# EAGLE design SLA_1500_CAM_V5 (EAGLE 9.2.1)
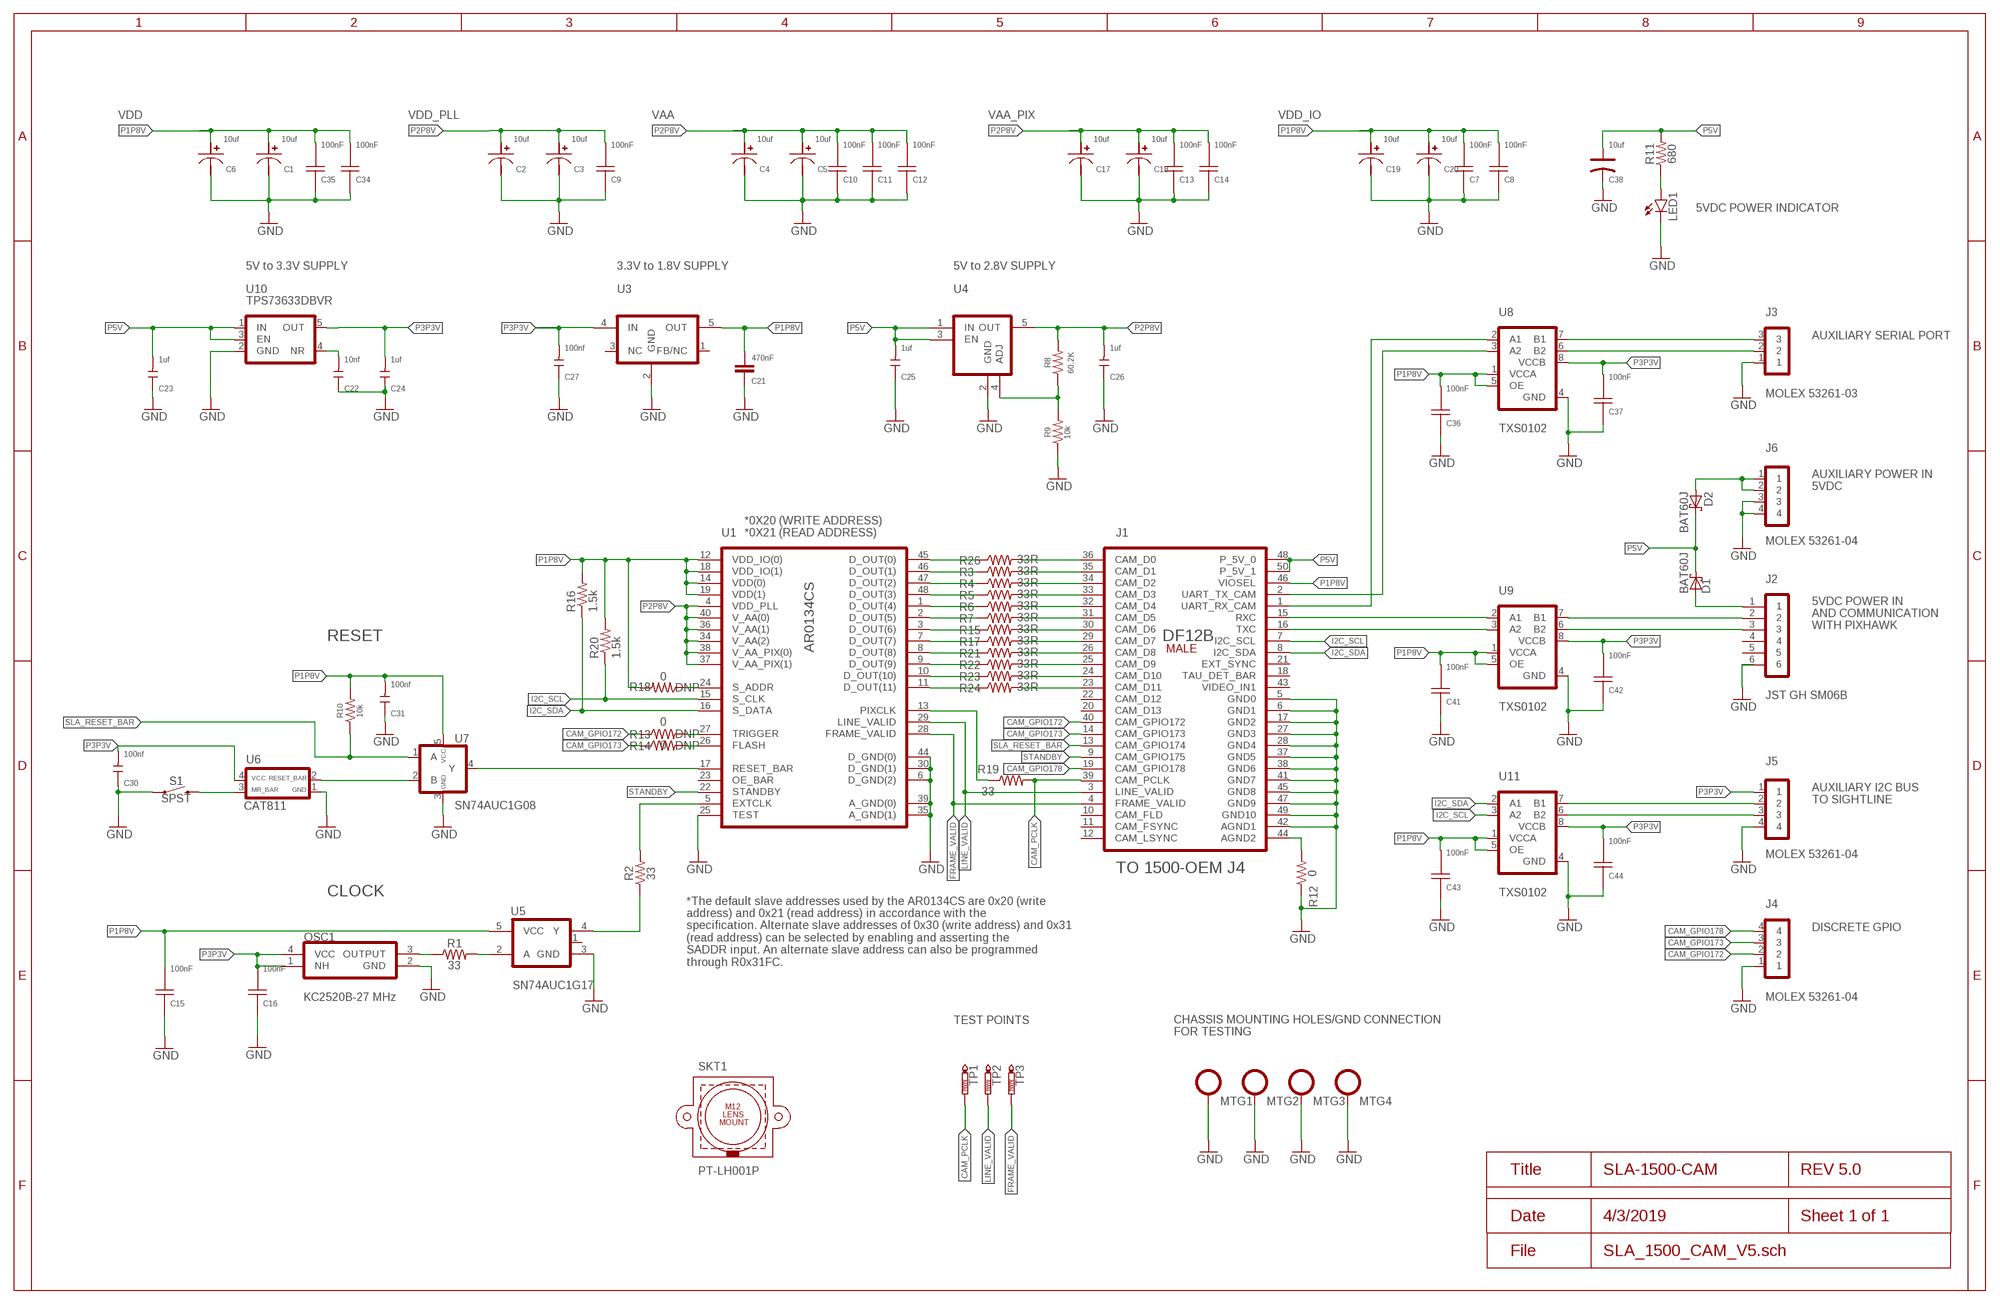
[diagram p0: schematic, sheet 1]
FRAME1 (FRAME_B_L): SPICEPREFIX: X

## Parts
C1  10uf  F980G106MUA  [0402]
C2  10uf  F980G106MUA  [0402]
C3  10uf  F980G106MUA  [0402]
C4  10uf  F980G106MUA  [0402]
C5  10uf  F980G106MUA  [0402]
C6  10uf  F980G106MUA  [0402]
C7  CAP0201100NF  [R0201]
C8  CAP0201100NF  [R0201]
C9  CAP0201100NF  [R0201]
C10  CAP0201100NF  [R0201]
C11  CAP0201100NF  [R0201]
C12  CAP0201100NF  [R0201]
C13  CAP0201100NF  [R0201]
C14  CAP0201100NF  [R0201]
C15  CAP0201100NF  [R0201]
C16  CAP0201100NF  [R0201]
C17  10uf  F980G106MUA  [0402]
C18  10uf  F980G106MUA  [0402]
C19  10uf  F980G106MUA  [0402]
C20  10uf  F980G106MUA  [0402]
C21  470nF  470NF-0402-16V-10%  [0402]
C22  10nf  CERAMIC-10NF-50V-10%-X7R(0402)  [C0402]
C23  1uf  CERAMIC-1UF-10V-10%-X5R(0402)  [C0402]
C24  1uf  CERAMIC-1UF-10V-10%-X5R(0402)  [C0402]
C25  1uf  CERAMIC-1UF-10V-10%-X5R(0402)  [C0402]
C26  1uf  CERAMIC-1UF-10V-10%-X5R(0402)  [C0402]
C27  100nf  CERAMIC-100NF-25V-10%-X7R(0402)  [C0402]
C30  100nf  CERAMIC-100NF-25V-10%-X7R(0402)  [C0402]
C31  100nf  CERAMIC-100NF-25V-10%-X7R(0402)  [C0402]
C34  CAP0201100NF  [R0201]
C35  CAP0201100NF  [R0201]
C36  CAP0201100NF  [R0201]
C37  CAP0201100NF  [R0201]
C38  10uf  TANTALUM-SMD-10UF-10V-10%(AVX-A)  [AVX-A]
C41  CAP0201100NF  [R0201]
C42  CAP0201100NF  [R0201]
C43  CAP0201100NF  [R0201]
C44  CAP0201100NF  [R0201]
D1  BAT60J  [SOD323_ST]
D2  BAT60J  [SOD323_ST]
J1  DF12B(5.0)-50DS-0.5(86)SMT  [DF12B(5.0)-50DS-0.5V(86)]
J2  JST GH SM06B  JST_GH_SM06B-GHS-TB  [JST_SM06B-GHS-TB]
J3  MOLEX 53261-03  MOLEX53261-03  [53261-03]
J4  MOLEX 53261-04  MOLEX53261-04  [53261-04]
J5  MOLEX 53261-04  MOLEX53261-04  [53261-04]
J6  MOLEX 53261-04  MOLEX53261-04  [53261-04]
LED1  LEDCHIP-LED0603  [CHIP-LED0603]
MTG1  SLA_MOUNTING  [SLA_MOUNTING]
MTG2  SLA_MOUNTING  [SLA_MOUNTING]
MTG3  SLA_MOUNTING  [SLA_MOUNTING]
MTG4  SLA_MOUNTING  [SLA_MOUNTING]
OSC1  KC2520B-27MHZ  [2.5X2.0_SMDCRYSTAL]
R1  33  RESISTOR0402  [0402]
R2  33  RESISTOR0402  [0402]
R3  33R  R-US_R0201  [R0201]
R4  33R  R-US_R0201  [R0201]
R5  33R  R-US_R0201  [R0201]
R6  33R  R-US_R0201  [R0201]
R7  33R  R-US_R0201  [R0201]
R8  60.2K  62KOHM-0603-1/10W-5%  [0603]
R9  10k  10KOHM-0603-1/10W-1%  [0603]
R10  10k  10KOHM-0603-1/10W-1%  [0603]
R11  680  680OHM-0603-1/10W-5%  [0603]
R12  0  RESISTOR0402  [0402]
R13  0  RESISTOR0402  [0402]
R14  0  RESISTOR0402  [0402]
R15  33R  R-US_R0201  [R0201]
R16  1.5k  R-US_R0201  [R0201]
R17  33R  R-US_R0201  [R0201]
R18  0  RESISTOR0402  [0402]
R19  33  RESISTOR0402  [0402]
R20  1.5k  R-US_R0201  [R0201]
R21  33R  R-US_R0201  [R0201]
R22  33R  R-US_R0201  [R0201]
R23  33R  R-US_R0201  [R0201]
R24  33R  R-US_R0201  [R0201]
R26  33R  R-US_R0201  [R0201]
S1  SPST  MOMENTARY-SWITCH-SPST-SMD-4.6X2.8MM  [TACTILE_SWITCH_SMD_4.6X2.8MM]
SKT1  PT-LH001P  M12_LENS_MOUNT  [M12_HOLDER]
TP1  PTR1TP08SQ  [TP08SQ]
TP2  PTR1TP08SQ  [TP08SQ]
TP3  PTR1TP08SQ  [TP08SQ]
U1  AR0134CS-ILCC48  [ILCC48_KD]
U3  TPS71518DCKR  [TI-SC70-5]
U4  AP7331-WG-7  [SOT-25]
U5  SN74AUC1G17  [SOT23-5]
U6  CAT811  [SOT-143-4]
U7  SN74AUC1G08  [SOT23-5]
U8  TXS0102  TXS0102DQM  [X2SON(8)1.8X1.2MM]
U9  TXS0102  TXS0102DQM  [X2SON(8)1.8X1.2MM]
U10  TPS73633DBVR  [SOT23-5]
U11  TXS0102  TXS0102DQM  [X2SON(8)1.8X1.2MM]

## Nets
CAM_GPIO172: J1.40(CAM_GPIO172) J4.2 R13.1
CAM_GPIO173: J1.14(CAM_GPIO173) J4.3 R14.1
CAM_GPIO178: J1.19(CAM_GPIO178) J4.4
CAM_PCLK: J1.39(CAM_PCLK) R19.2 TP1.TP
FRAME_VALID: J1.4(FRAME_VALID) TP3.TP U1.28(FRAME_VALID)
GND: C1.2 C2.2 C3.2 C4.2 C5.2 C6.2 C7.2 C8.2 C9.2 C10.2 C11.2 C12.2 C13.2 C14.2 C15.2 C16.2 C17.2 C18.2 C19.2 C20.2 C21.2 C22.1 C23.1 C24.1 C25.1 C26.1 C27.1 C30.1 C31.1 C34.2 C35.2 C36.2 C37.2 C38.- C41.2 C42.2 C43.2 C44.2 J1.5(GND0) J1.6(GND1) J1.17(GND2) J1.27(GND3) J1.28(GND4) J1.37(GND5) J1.38(GND6) J1.41(GND7) J1.42(AGND1) J1.45(GND8) J1.47(GND9) J1.49(GND10) J2.6 J3.1 J4.1 J5.4 J6.3 J6.4 LED1.C MTG1.P$1 MTG2.P$1 MTG3.P$1 MTG4.P$1 OSC1.2(GND) R9.1 R12.1 S1.1 S1.2 U1.6(D_GND(2)) U1.25(TEST) U1.30(D_GND(1)) U1.35(A_GND(1)) U1.39(A_GND(0)) U1.44(D_GND(0)) U3.2(GND) U4.2(GND) U5.3(GND) U6.1(GND) U7.3(GND) U8.4(GND) U9.4(GND) U10.2(GND) U11.4(GND)
I2C_SCL: J1.7(I2C_SCL) R20.1 U1.15(S_CLK) U11.3(A2)
I2C_SDA: J1.8(I2C_SDA) R16.1 U1.16(S_DATA) U11.2(A1)
LINE_VALID: J1.3(LINE_VALID) TP2.TP U1.29(LINE_VALID)
N$1: J2.3 U9.6(B2)
N$2: R26.1 U1.45(D_OUT(0))
N$3: J1.36(CAM_D0) R26.2
N$4: R3.1 U1.46(D_OUT(1))
N$5: J1.35(CAM_D1) R3.2
N$6: R4.1 U1.47(D_OUT(2))
N$7: J1.34(CAM_D2) R4.2
N$8: R5.1 U1.48(D_OUT(3))
N$9: J1.33(CAM_D3) R5.2
N$10: R6.1 U1.1(D_OUT(4))
N$11: J1.32(CAM_D4) R6.2
N$12: R7.1 U1.2(D_OUT(5))
N$13: J3.3 U8.7(B1)
N$14: J1.31(CAM_D5) R7.2
N$15: R1.2 U5.2(A)
N$16: OSC1.3(OUTPUT) R1.1
N$17: J2.2 U9.7(B1)
N$18: J3.2 U8.6(B2)
N$19: J1.1(UART_RX_CAM) U8.2(A1)
N$20: J1.2(UART_TX_CAM) U8.3(A2)
N$21: C22.2 U10.4(NR)
N$22: R15.1 U1.3(D_OUT(6))
N$23: R8.1 R9.2 U4.4(ADJ)
N$24: J1.30(CAM_D6) R15.2
N$25: R2.1 U5.4(Y)
N$26: R2.2 U1.5(EXTCLK)
N$27: S1.3 S1.4 U6.3(MR_BAR)
N$28: U6.2(RESET_BAR) U7.2(B)
N$29: U1.17(RESET_BAR) U7.4(Y)
N$30: LED1.A R11.1
N$31: J1.44(AGND2) R12.2
N$32: R13.2 U1.27(TRIGGER)
N$33: R14.2 U1.26(FLASH)
N$34: D1.A J2.1
N$35: J1.15(RXC) U9.2(A1)
N$36: J1.16(TXC) U9.3(A2)
N$37: J5.2 U11.7(B1)
N$38: J5.3 U11.6(B2)
N$39: D2.A J6.1 J6.2
N$40: R17.1 U1.7(D_OUT(7))
N$41: J1.29(CAM_D7) R17.2
N$42: R21.1 U1.8(D_OUT(8))
N$43: J1.26(CAM_D8) R21.2
N$44: R22.1 U1.9(D_OUT(9))
N$45: J1.25(CAM_D9) R22.2
N$46: R23.1 U1.10(D_OUT(10))
N$47: J1.24(CAM_D10) R23.2
N$48: R24.1 U1.11(D_OUT(11))
N$49: J1.23(CAM_D11) R24.2
N$52: R18.1 U1.24(S_ADDR)
P1P8V: C1.1 C6.1 C7.1 C8.1 C15.1 C19.1 C20.1 C21.1 C31.2 C34.1 C35.1 C36.1 C41.1 C43.1 J1.46(VIOSEL) R10.2 R16.2 R18.2 R20.2 U1.12(VDD_IO(0)) U1.14(VDD(0)) U1.18(VDD_IO(1)) U1.19(VDD(1)) U3.5(OUT) U5.5(VCC) U7.5(VCC) U8.1(VCCA) U8.5(OE) U9.1(VCCA) U9.5(OE) U11.1(VCCA) U11.5(OE)
P2P8V: C2.1 C3.1 C4.1 C5.1 C9.1 C10.1 C11.1 C12.1 C13.1 C14.1 C17.1 C18.1 C26.2 R8.2 U1.4(VDD_PLL) U1.34(V_AA(2)) U1.36(V_AA(1)) U1.37(V_AA_PIX(1)) U1.38(V_AA_PIX(0)) U1.40(V_AA(0)) U4.5(OUT)
P3P3V: C16.1 C24.2 C27.2 C30.2 C37.1 C42.1 C44.1 J5.1 OSC1.1(NH) OSC1.4(VCC) U3.4(IN) U6.4(VCC) U8.8(VCCB) U9.8(VCCB) U10.5(OUT) U11.8(VCCB)
P5V: C23.2 C25.2 C38.+ D1.C D2.C J1.48(P_5V_0) J1.50(P_5V_1) R11.2 U4.1(IN) U4.3(EN) U10.1(IN) U10.3(EN)
PIXCLK: R19.1 U1.13(PIXCLK)
SLA_RESET_BAR: J1.13(CAM_GPIO174) R10.1 U7.1(A)
STANDBY: J1.9(CAM_GPIO175) U1.22(STANDBY)
Unconnected: J1.10(CAM_FLD) J1.11(CAM_FSYNC) J1.12(CAM_LSYNC) J1.18(TAU_DET_BAR) J1.20(CAM_D13) J1.21(EXT_SYNC) J1.22(CAM_D12) J1.43(VIDEO_IN1) J2.4 J2.5 U1.23(OE_BAR) U3.1(FB/NC) U3.3(NC) U5.1(NC)

## Notes on the sheet
- VDD | VDD_PLL | VAA | VAA_PIX | VDD_IO
- 5VDC POWER INDICATOR
- 5V to 3.3V SUPPLY | 3.3V to 1.8V SUPPLY | 5V to 2.8V SUPPLY
- AUXILIARY SERIAL PORT
- AUXILIARY POWER IN
  5VDC
- *0X20 (WRITE ADDRESS)
  *0X21 (READ ADDRESS)
- 5VDC POWER IN 
  AND COMMUNICATION 
  WITH PIXHAWK
- RESET
- DNP
- DNP
- DNP
- AUXILIARY I2C BUS 
  TO SIGHTLINE
- TO 1500-OEM J4
- CLOCK
- DISCRETE GPIO
- *The default slave addresses used by the AR0134CS are 0x20 (write
  address) and 0x21 (read address) in accordance with the
  specification. Alternate slave addresses of 0x30 (write address) and 0x31 
  (read address) can be selected by enabling and asserting the
  SADDR input. An alternate slave address can also be programmed
  through R0x31FC.
- TEST POINTS
- CHASSIS MOUNTING HOLES/GND CONNECTION
  FOR TESTING

## Library data of the parts
C1-C6 C17-C20 = Sightline:F980G106MUA: F980G106MUA Tantalum Capacitors - Solid SMD 10uF 4V 20% 0402, 1.1x0.6x0.35mm F98 SERIES DATASHEET <https://www.mouser.com/datasheet/2/40/f98-775787.pdf>; DESCRIPTION: Tantalum Capacitors - Solid SMD 10uF 4V 20% 0402, 1.1x0.6x0.35mm; MANF: AVX; MANF#: F980G106MUA
C7-C16 C34-C37 C41-C44 = Sightline:CAP0201: CAP0201 PANASONIC CERAMIC CAPACITOR CAP, CERAMIC, 100nF, 10V, X5R, 20%, 0201; DESCRIPTION: CAP, CERAMIC, 100nF, 10V, X5R, 20%, 0201; MANF: PANASONIC; MANF#: ECJZEB1A104M
C21 = SparkFun-Capacitors:470NF: 0.47uF/470nF ceramic capacitors A capacitor is a passive two-terminal electrical component used to store electrical energy temporarily in an electric field.; PROD_ID: CAP-09041
C22 = Seeed-Capacitor:CERAMIC-10NF-50V-10%-X7R(0402): 302010006; MPN: CC0402KRX7R9BB103
C23-C26 = Seeed-Capacitor:CERAMIC-1UF-10V-10%-X5R(0402): 302010040; MPN: CC0402KRX5R6BB105
C27 C30 C31 = Seeed-Capacitor:CERAMIC-100NF-25V-10%-X7R(0402): 302010024; MPN: CC0402KRX7R8BB104
C38 = Seeed-Capacitor:TANTALUM-SMD-10UF-10V-10%(AVX-A): 302020011; MPN: TAJA106K010RNJ
D1 D2 = diode:BAT60J: Schottky barrier diode Source: www.st.com, BAT60J.pdf
J1 = Sightline:DF12B(5.0)-50DS-0.5(86): DF12B(5.0)-50DS-0.5(86) DF12 Series 0.5 mm Pitch SMT Board-to-Board Connector (MALE) Specifications Manufacturer: Hirose Manufacturer Part Number: 537-0309-6 86 Operating Temperature Range(C): -45 - 125 Current Rating: 0.3A Voltage Rating: 50V AC Body Size(mm): 14.6 x 3.6 DF12B(5.0)-50DS DATASHEET <https://www.hirose.com/product/en/products/DF12/> Created by: Kimball S. Davis kimball4@pdx.edu <mailto: kimball4@pdx.edu> 21 January 2019 Version 001; DESCRIPTION: DF12B-50DS-0.5V(86) Hirose Male 50-pin connector; MANF: Hirose; MANF#: 537-0309-6 86
J2 = Sightline:JST_GH_SM06B-GHS-TB: JST SM06B-GHS-TB JST Type GH 1.25mm side-entry smt 6-pin connector Specifications Manufacturer: JST Manufacturer Part Number: SM06B-GHS-TB Body Size(mm): 10.75 X 4.25 JST TYPE GH DATASHEET <http://www.jst-mfg.com/product/pdf/eng/eGH.pdf> Created by: Kimball S. Davis 5 February 2019 Version 001; DESCRIPTION: 1.25 MM SIDE-ENTRY 6-PIN SMT CONNECTOR; MANF: JST; MANF#: SM06B-GHS-TB
J3 = Sightline:MOLEX53261-03: MOLEX 53261-03 1.25mm Pitch PicoBlade Header, Surface Mount, Right-Angle, 3 Circuits, Tin (Sn) Plating 53261-03 DATASHEET <https://www.molex.com/webdocs/datasheets/pdf/en-us/0532610371_PCB_HEADERS.pdf>; DESCRIPTION: 1.25mm Pitch PicoBlade Header, Surface Mount, Right-Angle, 3 Circuits, Tin (Sn) Plating; MANF: MOLEX; MANF#: 532610371
J4-J6 = Sightline:MOLEX53261-04: MOLEX 53261-04 1.25mm Pitch PicoBlade Header, Surface Mount, Right-Angle, 4 Circuits, Tin (Sn) Plating 53261-04 DATASHEET <https://www.molex.com/webdocs/datasheets/pdf/en-us/0532610471_PCB_HEADERS.pdf>; DESCRIPTION: 1.25mm Pitch PicoBlade Header, Surface Mount, Right-Angle, 4 Circuits, Tin (Sn) Plating; MANF: MOLEX; MANF#: 532610471
LED1 = led:LED: LED OSRAM: - CHIPLED LG R971, LG N971, LY N971, LG Q971, LY Q971, LO R971, LY R971 LH N974, LH R974 LS Q976, LO Q976, LY Q976 LO Q996 - Hyper CHIPLED LW Q18S LB Q993, LB Q99A, LB R99A - SideLED LS A670, LO A670, LY A670, LG A670, LP A670 LB A673, LV A673, LT A673, LW A673 LH A674 LY A675 LS A676, LA A676, LO A676, LY A676, LW A676 LS A679, LY A679, LG A679 - Hyper Micro SIDELED® LS Y876, LA Y876, LO Y876, LY Y876 LT Y87S - SmartLED LW L88C, LW L88S LB L89C, LB L89S, LG L890 LS L89K, LO L89K, LY L89K LS L896, LA L896, LO L896, LY L896 - TOPLED LS T670, LO T670, LY T670, LG T670, LP T670 LSG T670, LSP T670, LSY T670, LOP T670, LYG T670 LG T671, LOG T671, LSG T671 LB T673, LV T673, LT T673, LW T673 LH T674 LS T676, LA T676, LO T676, LY T676, LB T676, LH T676, LSB T676, LW T676 LB T67C, LV T67C, LT T67C, LS T67K, LO T67K, LY T67K, LW E67C LS E67B, LA E67B, LO E67B, LY E67B, LB E67C, LV E67C, LT E67C LW T67C LS T679, LY T679, LG T679 LS T770, LO T770, LY T770, LG T770, LP T770 LB T773, LV T773, LT T773, LW T773 LH T774 LS E675, LA E675, LY E675, LS T675 LS T776, LA T776, LO T776, LY T776, LB T776 LHGB T686 LT T68C, LB T68C - Hyper Mini TOPLED® LB M676 - Mini TOPLED Santana® LG M470 LS M47K, LO M47K, LY M47K Source: http://www.osram.convergy.de LUXEON: - LUMILED® LXK2-PW12-R00, LXK2-PW12-S00, LXK2-PW14-U00, LXK2-PW14-V00 LXK2-PM12-R00, LXK2-PM12-S00, LXK2-PM14-U00 LXK2-PE12-Q00, LXK2-PE12-R00, LXK2-PE12-S00, LXK2-PE14-T00, LXK2-PE14-U00 LXK2-PB12-K00, LXK2-PB12-L00, LXK2-PB12-M00, LXK2-PB14-N00, LXK2-PB14-P00, LXK2-PB14-Q00 LXK2-PR12-L00, LXK2-PR12-M00, LXK2-PR14-Q00, LXK2-PR14-R00 LXK2-PD12-Q00, LXK2-PD12-R00, LXK2-PD12-S00 LXK2-PH12-R00, LXK2-PH12-S00 LXK2-PL12-P00, LXK2-PL12-Q00, LXK2-PL12-R00 Source: www.luxeon.com KINGBRIGHT: KA-3528ASYC Source: www.kingbright.com
MTG1-MTG4 = Sightline:SLA_MOUNTING
OSC1 = Sightline:KC2520B-27MHZ: KC2520B-27MHz-2.5X2.0 27 MHz SMT Clock Oscillator with CMOS output Specifications Manufacturer: Kyocera Manufacturer Part Number: KC2520B27.0000C2GE00 Supply Voltage: 1.8 to 3.3V Body Size(mm): 2.5 x 2.0 KC2520B DATASHEET <https://www.mouser.com/datasheet/2/909/kc2520b_c1_e-1388834.pdf> Created by: Kimball S. Davis 25 January 2019 Version 001; DESCRIPTION: OSC, CRYSTAL CLOCK, SMD, CMOS, 2.25V TO 3.63V, 4mA, 27.0000MHz, 2.5MM x 2.0MM; MANF: Kyocera; MANF#: KC2520B27.0000C2GE00
R1 R2 R12-R14 R18 R19 = SparkFun-Resistors:RESISTOR: Generic Resistor Package
R3-R7 R15-R17 R20-R24 R26 = resistor:R-US_: RESISTOR, American symbol
R8 = SparkFun-Resistors:62KOHM: 62kΩ resistor A resistor is a passive two-terminal electrical component that implements electrical resistance as a circuit element. Resistors act to reduce current flow, and, at the same time, act to lower voltage levels within circuits. - Wikipedia
R9 R10 = SparkFun-Resistors:10KOHM: 10kΩ resistor A resistor is a passive two-terminal electrical component that implements electrical resistance as a circuit element. Resistors act to reduce current flow, and, at the same time, act to lower voltage levels within circuits. - Wikipedia; PROD_ID: RES-00824
R11 = SparkFun-Resistors:680OHM: 680Ω resistor A resistor is a passive two-terminal electrical component that implements electrical resistance as a circuit element. Resistors act to reduce current flow, and, at the same time, act to lower voltage levels within circuits. - Wikipedia; PROD_ID: RES-09333
S1 = SparkFun-Switches:MOMENTARY-SWITCH-SPST: Momentary Switch (Pushbutton) - SPST Normally-open (NO) SPST momentary switches (buttons, pushbuttons). Variants PTH-12MM - 12mm square, through-hole Momentary Pushbutton Switch - 12mm Square <https://www.sparkfun.com/products/9190> (COM-09190) PTH-6.0MM, PTH-6.0MM-KIT - 6.0mm square, through-hole Mini Pushbutton Switch <https://www.sparkfun.com/products/97> (COM-00097) KIT package intended for soldering kit's - only one side of pads' copper is exposed. PTH-RIGHT-ANGLE-KIT - Right-angle, through-hole Right Angle Tactile Button <https://www.sparkfun.com/products/10791> - Used on SparkFun BigTime Watch Kit <https://www.sparkfun.com/products/11734> SMD-12MM - 12mm square, surface-mount Tactile Button - SMD (12mm) <https://www.sparkfun.com/products/12993> (COM-12993) Used on SparkFun PicoBoard <https://www.sparkfun.com/products/11888> SMD-4.5MM - 4.5mm Square Trackball Switch Used on SparkFun Blackberry Trackballer Breakout <https://www.sparkfun.com/products/13169> SMD-4.6MMX2.8MM - 4.60mm x 2.80mm, surface mount Used on SparkFun SAMD21 Mini Breakout <https://www.sparkfun.com/products/13664> SMD-5.2MM, SMD-5.2-REDUNDANT - 5.2mm square, surface-mount Mini Pushbutton Switch - SMD <https://www.sparkfun.com/products/8720> (COM-08720) Used on Arduino Pro Mini <https://www.sparkfun.com/products/11114> REDUNDANT package connects both switch circuits together SMD-6.0X3.5MM - 6.0 x 3.5mm, surface mount Momentary Reset Switch SMD <https://www.sparkfun.com/products/8229> (COM-08229) SMD-6.2MM-TALL - 6.2mm square, surface mount Tactile Button - SMD (6mm) <https://www.sparkfun.com/products/12992> Used on SparkFun Digital Sandbox <https://www.sparkfun.com/products/12651> SMD-RIGHT-ANGLE - Right-angle, surface mount Used on SparkFun Block for Intel® Edison - Arduino <https://www.sparkfun.com/products/13036>; PROD_ID: SWCH-13065
SKT1 = Sightline:M12_LENS_MOUNT: PT-LH001P PT-LH001P Plastic M12 Lens Holder, 20mm Hole Spacing; DESCRIPTION: PT-LH001P Plastic M12 Lens Holder, 20mm Hole Spacing; MANF: M12 LENSES; MANF#: PT-LH001P
TP1-TP3 = testpad:PTR1: TEST PIN
U1 = Sightline:AR0134CS-ILCC48: AR0134CS-1LCC48-10x10 1/3-inch 1.2 Mp CMOS digital image sensor with an active-pixel array of 1280 (H) × 960 (V) Specifications Manufacturer: On Semiconductor Manufacturer Part Number: AR0134CSSM00SPCA0 Operating Temperature Range(C): -30 - 70 Supply Voltage: I/O: 1.8 or 2.8V Digital: 1.8V Analog: 2.8V HiSPi: 0.4V Body Size(mm): 10 x 10 ARO134CS DATASHEET <https://www.onsemi.com/pub/Collateral/AR0134CS-D.PDF> Created by: Kimball S. Davis kimball4@pdx.edu <mailto: kimball4@pdx.edu> 22 January 2019 Version 001; DESCRIPTION: 1/3-inch 1.2 Mp CMOS digital image sensor with an active-pixel array of 1280 (H) × 960 (V); MANF: On Semiconductor; MANF#: AR0134CSSM00SPCA0
U3 = Sightline:TPS71518DCKR: TPS71518DCKR 50-mA, 24-V, 3.2-μA Supply Current Low-Dropout Linear Regulator in SC70 5-Pin Package, 3.3 to 1.8V, 2.15 x 1.4mm TPS71518DCKR DATASHEET <http://www.ti.com/lit/ds/symlink/tps715.pdf>; DESCRIPTION: 50-mA, 24-V, 3.2-μA Supply Current Low-Dropout Linear Regulator in SC70 5-Pin Package, 3.3 to 1.8V, 2.15 x 1.4mm; MANF: TEXAS INSTRUMENTS; MANF#: TPS71518DCKR
U4 = Sightline:AP7331-WG-7: AP7331-WG-7 300mA, LOW QUIESCENT CURRENT, FAST TRANSIENT LOW DROPOUT LINEAR REGULATOR, ADJUSTABLE OUTPUT, 5V to 2.8V, 3.1 x 1.7mm AP7331 DATASHEET <https://www.diodes.com/assets/Datasheets/AP7331.pdf>; DESCRIPTION: 300mA, LOW QUIESCENT CURRENT, FAST TRANSIENT LOW DROPOUT LINEAR REGULATOR, ADJUSTABLE OUTPUT, 5V to 2.8V, 3.1 x 1.7mm; MANF: DIODES INCORPORATED; MANF#: AP7331-WG-7
U5 = Sightline:SN74AUC1G17: SN74AUC1G17-SOT23-5 IC, BUFFER, SINGLE SCHMITT-TRIGGER, 9mA, 0.8V TO 2.7V, SOT23-5 Specifications Manufacturer: Texas Instruments Manufacturer Part Number: SN74AUC1G17DBVR Supply Voltage: 3.6V Max Body Size(mm): 2.9 x 1.6 SN74AUC1G17 DATASHEET <http://www.ti.com/lit/ds/symlink/sn74auc1g17.pdf> Created by: Kimball S. Davis 24 January 2019 Version 001; DESCRIPTION: IC, BUFFER, SINGLE SCHMITT-TRIGGER, 9mA, 0.8V TO 2.7V, SOT23-5; MANF: TEXAS INSTRUMENTS; MANF#: SN74AUC1G17DBV
U6 = Sightline:CAT811: CAT811-SOT-143-4 IC, SUPERVISOR, MICROPROCESSOR POWER SUPPLY, 2.93V, ACTIVE LOW RESET, SOT143-4 Specifications Manufacturer: On Semiconductor Manufacturer Part Number: CAT811STBI Body Size(mm): 2.9 x 1.3 CAT811 DATASHEET <https://www.onsemi.com/pub/Collateral/CAT811-D.PDF> Created by: Kimball S. Davis 23 January 2019 Version 001; DESCRIPTION: IC, SUPERVISOR, MICROPROCESSOR POWER SUPPLY, 2.93V, ACTIVE LOW RESET, SOT143-4; MANF: On Semiconductor; MANF#: CAT811STBI
U7 = Sightline:SN74AUC1G08: SN74AUC1G08-SOT23-5 Single 2-Input Positive-AND Gate Specifications Manufacturer: Texas Instruments Manufacturer Part Number: SN74AUC1G08DBVR Supply Voltage: 1.65 - 1.95V Body Size(mm): 2.9 x 1.6 SN74AUC1G08 DATASHEET <http://www.ti.com/lit/ds/symlink/sn74auc1g08.pdf>; DESCRIPTION: IC, AND GATE, SINGLE, 2 INPUT POSITIVE, SGL, SOT23-5; MANF: Texas Instruments; MANF#: SN74AUC1G08DBVR
U8 U9 U11 = Sightline:TXS0102DQM: TXS0102DQM 1.8 X 1.2 mm TXS0102 2-Bit Bidirectional Voltage-Level Translator TXS0102 DATASHEET <http://www.ti.com/lit/ds/symlink/txs0102.pdf>; DESCRIPTION: TXS0102 2-Bit Bidirectional Voltage-Level Translator for Open-Drain and Push-Pull Applications; MANF: Texas Instruments; MANF#: TXS0102DQM
U10 = Sightline:TPS73633DBVR: TPS73633DBVR Cap-Free, NMOS, 400-mA Low-Dropout Regulator with Reverse Current Protection 5.5 to 3.3V, SOT-23 5-pin, 2.9 x 1.6 mm TPS73633DBVR DATASHEET <http://www.ti.com/lit/ds/symlink/tps736.pdf>; DESCRIPTION: Cap-Free, NMOS, 400-mA Low-Dropout Regulator with Reverse Current Protection 5.5 to 3.3V, SOT-23 5-pin, 2.9 x 1.6 mm; MANF: Texas Instruments; MANF#: TPS73633DBVR

## Board
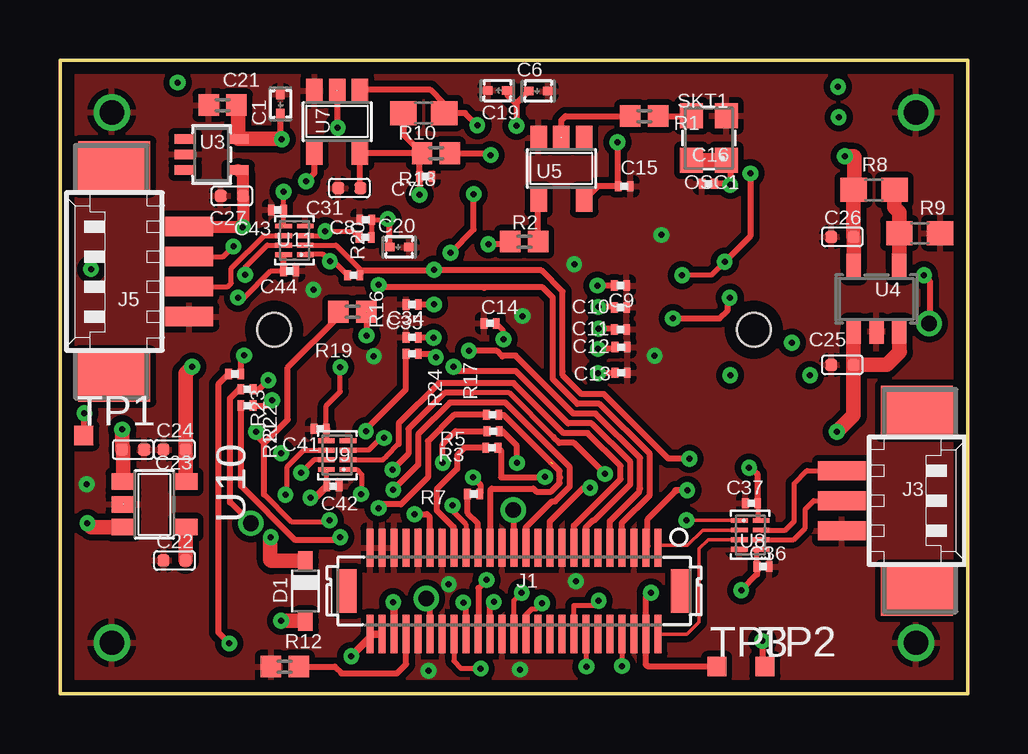
[diagram p1: board, top side]
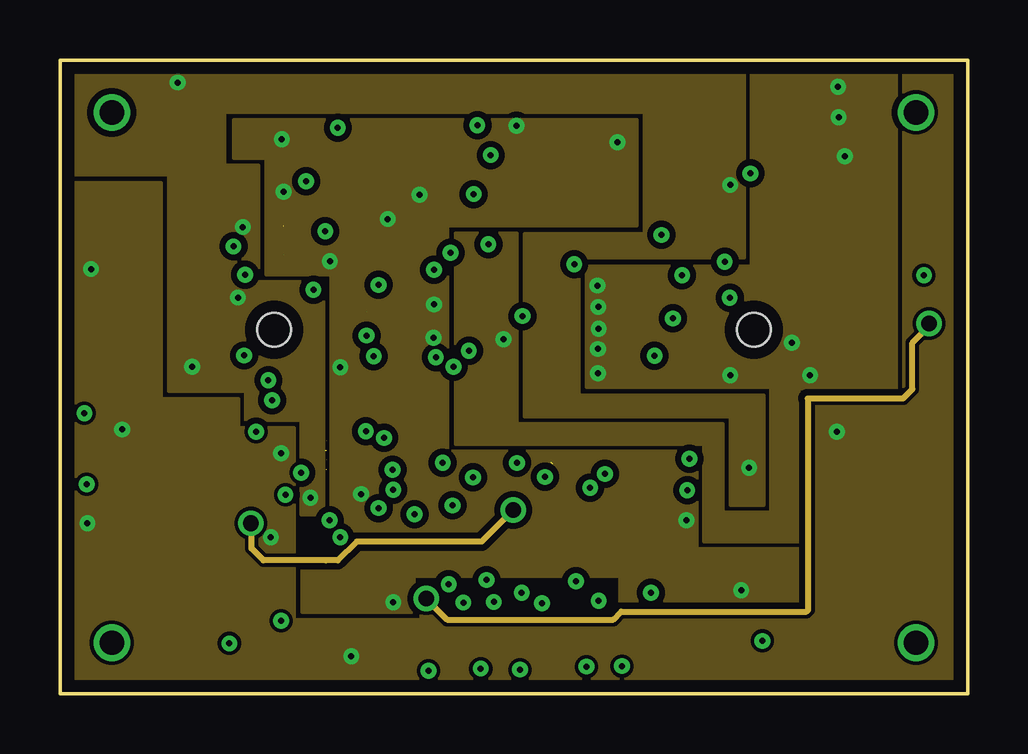
[diagram p2: board, inner layer Route2]
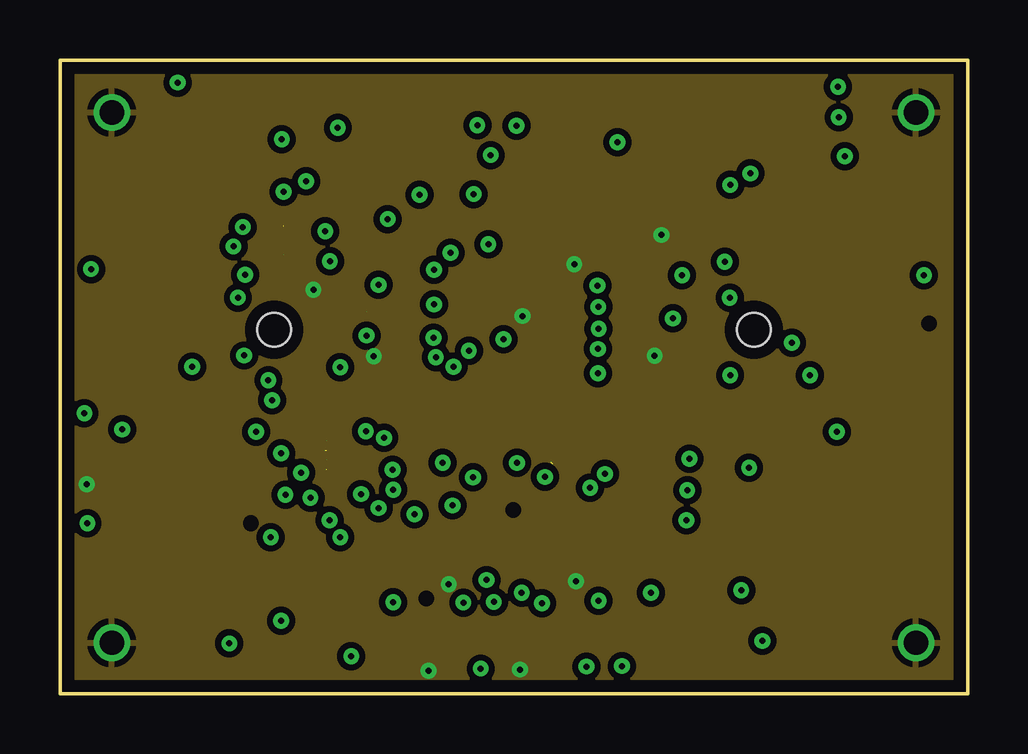
[diagram p3: board, inner layer Route15]
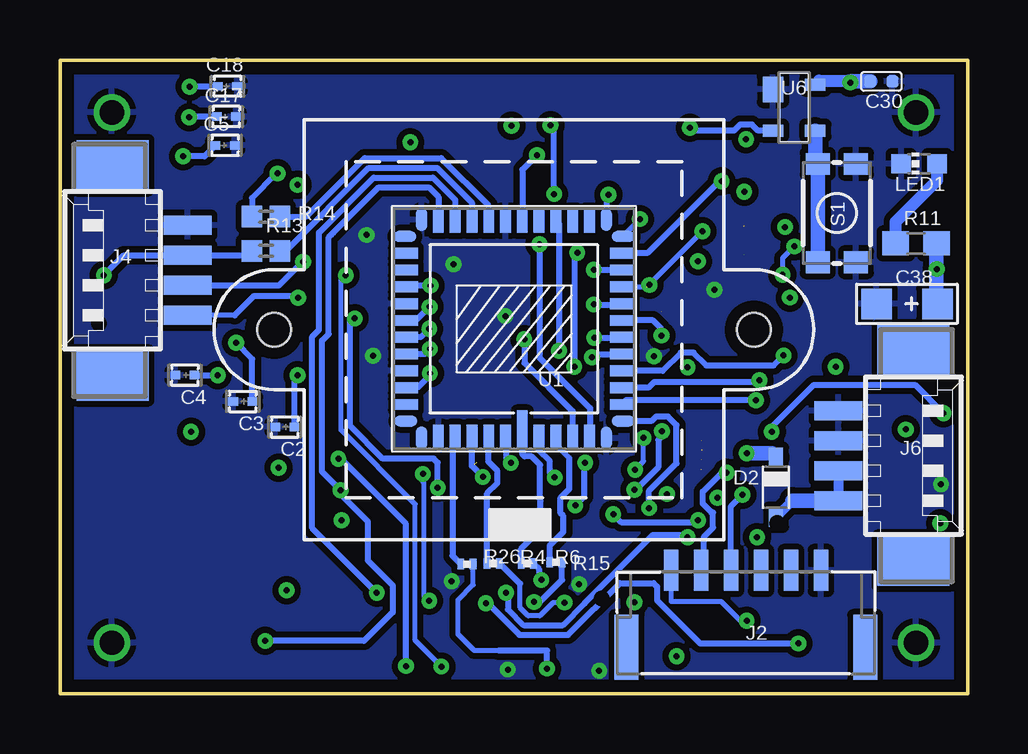
[diagram p4: board, bottom side, seen from below]

Size 37.85 x 26.42 mm. Coordinates in mm from the lower left corner, seen from the top.
Outline: 0,0 0.18,0
Outline: 0.18,0 37.85,0 37.85,26.42 0,26.42 0,0
Outline: 0,0 0.18,0
Copper layers ([2:[15:1+2*15+16:2]:15]): Top 0.0178mm / dielectric 12mil / Route2 0.0356mm / dielectric 28mil / Route15 0.0356mm / dielectric 12mil / Bottom 0.0178mm
Design rules "SSC-EAGLE-4Lyr_v1.0.0.3 *": minimum track width 6mil, minimum drill 8mil, track to track 6mil, track to pad 6mil, pad to pad 6mil, via to via 6mil, smd to smd 6mil, copper to edge 20mil, drill to drill 16mil, minimum pad ring 8mil, minimum via ring 8mil, stop-mask expansion 3mil, vias tented up to drill 0mil, thermal gap 10mil

### Footprints (pad centres in the part's own frame; a part is rotated, then mirrored left to right if it is on the bottom)
0402 = smd 0.4 x 0.35: 1 -0.4,0; 2 0.4,0
R0201 = smd 0.28 x 0.43: 1 -0.255,0; 2 0.255,0
0402' = smd 0.85 x 0.9: 1 -0.58,0; 2 0.58,0
C0402 = smd 0.5 x 0.5: 1 0,0.463; 2 0,-0.463
AVX-A = smd 1.27 x 1.27: + -1.27,0; - 1.27,0
SOD323_ST = smd 0.8 x 0.6: A 1.25,0; C -1.25,0
DF12B(5.0)-50DS-0.5V(86) = smd 1.6 x 0.3: 1 -1.8,6; 2 1.8,6; 3 -1.8,5.5; 4 1.8,5.5; 5 -1.8,5; 6 1.8,5; 7 -1.8,4.5; 8 1.8,4.5; 9 -1.8,4; 10 1.8,4; 11 -1.8,3.5; 12 1.8,3.5; 13 -1.8,3; 14 1.8,3; 15 -1.8,2.5; 16 1.8,2.5; 17 -1.8,2; 18 1.8,2; 19 -1.8,1.5; 20 1.8,1.5; 21 -1.8,1; 22 1.8,1; 23 -1.8,0.5; 24 1.8,0.5; 25 -1.8,0; 26 1.8,0; 27 -1.8,-0.5; 28 1.8,-0.5; 29 -1.8,-1; 30 1.8,-1; 31 -1.8,-1.5; 32 1.8,-1.5; 33 -1.8,-2; 34 1.8,-2; 35 -1.8,-2.5; 36 1.8,-2.5; 37 -1.8,-3; 38 1.8,-3; 39 -1.8,-3.5; 40 1.8,-3.5; 41 -1.8,-4; 42 1.8,-4; 43 -1.8,-4.5; 44 1.8,-4.5; 45 -1.8,-5; 46 1.8,-5; 47 -1.8,-5.5; 48 1.8,-5.5; 49 -1.8,-6; 50 1.8,-6 | smd 1.8 x 0.8: P$51 0,6.95; P$52 0,-6.95
JST_SM06B-GHS-TB = smd 0.6 x 1.7: 1 -3.23,1.95; 2 -1.98,1.95; 3 -0.73,1.95; 4 0.52,1.95; 5 1.77,1.95; 6 3.02,1.95 | smd 1 x 2.7: P$7 -5.08,-1.25; P$8 4.87,-1.25
53261-03 = smd 0.8 x 2: 1 1.25,-2.5; 2 0,-2.5; 3 -1.25,-2.5 | smd 2.1 x 3: S1 3.75,0.625; S2 -3.75,0.625
53261-04 = smd 0.8 x 2: 1 1.875,-2.5; 2 0.625,-2.5; 3 -0.625,-2.5; 4 -1.875,-2.5 | smd 2.1 x 3: S1 4.375,0.625; S2 -4.375,0.625
CHIP-LED0603 = smd 0.8 x 0.8: A 0,-0.75; C 0,0.75
SLA_MOUNTING = drill 1.016: P$1 0,0
2.5X2.0_SMDCRYSTAL = smd 1.05 x 0.95: 1 -0.925,-0.725; 2 0.925,-0.725; 3 0.925,0.725; 4 -0.925,0.725
0603 = smd 1.1 x 1: 1 -0.85,0; 2 0.85,0
TACTILE_SWITCH_SMD_4.6X2.8MM = smd 0.9 x 1: 1 -2.05,-0.8; 2 2.05,-0.8; 3 2.05,0.8; 4 -2.05,0.8
M12_HOLDER = hole 1.4: -10,0; 10,0
TP08SQ = smd 0.8 x 0.8: TP 0,0
ILCC48_KD = smd 0.45 x 1.6: 1 -0.35,4.2 | smd 0.45 x 1: 2 -1.05,4.5; 3 -1.75,4.5; 4 -2.45,4.5; 5 -3.15,4.5; 20 -3.15,-4.5; 21 -2.45,-4.5; 22 -1.75,-4.5; 23 -1.05,-4.5; 24 -0.35,-4.5; 25 0.35,-4.5; 26 1.05,-4.5; 27 1.75,-4.5; 28 2.45,-4.5; 29 3.15,-4.5; 44 3.15,4.5; 45 2.45,4.5; 46 1.75,4.5; 47 1.05,4.5; 48 0.35,4.5 | smd 0.45 x 0.95: 6 -3.85,4.55; 19 -3.85,-4.55; 30 3.85,-4.55; 43 3.85,4.55 | smd 0.95 x 0.45: 7 -4.55,3.85; 18 -4.55,-3.85; 31 4.55,-3.85; 42 4.5,3.85 | smd 1 x 0.45: 8 -4.5,3.15; 9 -4.5,2.45; 10 -4.5,1.75; 11 -4.5,1.05; 12 -4.5,0.35; 13 -4.5,-0.35; 14 -4.5,-1.05; 15 -4.5,-1.75; 16 -4.5,-2.45; 17 -4.5,-3.15; 32 4.5,-3.15; 33 4.5,-2.45; 34 4.5,-1.75; 35 4.5,-1.05; 36 4.5,-0.35; 37 4.5,0.35; 38 4.5,1.05; 39 4.5,1.75; 40 4.5,2.45; 41 4.5,3.15
TI-SC70-5 = smd 0.4 x 0.9: 1 -0.65,-1.1; 2 0,-1.1; 3 0.65,-1.1; 4 0.65,1.1; 5 -0.65,1.1
SOT-25 = smd 0.6 x 1.05: 1 -0.95,-1.35; 2 0,-1.35; 3 0.95,-1.35; 4 0.95,1.35; 5 -0.95,1.35
SOT23-5 = smd 0.69 x 0.99: 1 -0.95,-1.29; 2 0,-1.29; 3 0.95,-1.29; 4 0.95,1.3; 5 -0.95,1.3
SOT-143-4 = smd 1.06 x 0.85: 1 -0.76,-0.88 | smd 0.5 x 0.85: 2 0.96,-0.88; 3 0.96,0.88; 4 -0.96,0.88
X2SON(8)1.8X1.2MM = smd 0.2 x 0.7: 1 -0.6,-0.45; 2 -0.2,-0.45; 3 0.2,-0.45; 4 0.6,-0.45; 5 0.6,0.45; 6 0.2,0.45; 7 -0.2,0.45; 8 -0.6,0.45

### Placement (x,y rotation side)
C1  9.19,24.59 90 top
C2  28.47,11.13 180 bottom
C3  30.23,12.19 180 bottom
C4  32.64,13.28 180 bottom
C5  30.96,22.86 0 bottom
C6  19.94,25.12 0 top
C7  15.24,21.56 0 top
C8  12.75,19.76 180 top
C9  23.37,17.02 0 top
C10  23.37,16.1 0 top
C11  23.37,15.19 0 top
C12  23.39,14.45 0 top
C13  23.39,13.39 0 top
C14  17.93,15.44 180 top
C15  23.52,21.16 0 top
C16  27.03,21.26 180 top
C17  30.91,24.05 0 bottom
C18  30.86,25.32 0 bottom
C19  18.24,25.15 180 top
C20  14.15,18.62 0 top
C21  470nF  [0402']  6.78,24.54 180 top
C22  4.78,5.56 90 top
C23  3.05,10.19 270 top
C24  4.78,10.19 90 top
C25  32.61,13.72 90 top
C26  32.61,19.05 90 top
C27  7.16,20.75 90 top
C30  3.61,25.53 270 bottom
C31  12.06,21.08 90 top
C34  14.68,16.23 180 top
C35  14.68,14.86 180 top
C36  29.31,5.31 0 top
C37  28.83,7.95 180 top
C38  2.54,16.26 180 bottom
C41  10.85,11.05 180 top
C42  11.38,8.66 0 top
C43  9.07,20.17 180 top
C44  9.58,17.63 0 top
D1  10.24,4.29 270 top
D2  8,8.61 270 bottom
J1  18.92,4.29 270 top
J2  9.14,3.2 0 bottom
J3  35.1,8.05 270 top
J4  35.03,17.65 90 bottom
J5  2.9,17.6 90 top
J6  2.9,9.93 270 bottom
LED1  2.03,22.1 90 bottom
MTG1  2.16,2.13 0 top
MTG2  35.69,2.13 0 top
MTG3  35.69,24.23 0 top
MTG4  2.16,24.23 0 top
OSC1  27.05,23.16 90 top
R1  33  [0402']  24.36,24.08 180 top
R2  33  [0402']  19.35,18.85 180 top
R3  18.01,10.26 180 top
R4  19.79,5.44 0 bottom
R5  18.06,10.95 180 top
R6  18.36,5.44 0 bottom
R7  17.25,8.33 180 top
R8  33.93,21.01 180 top
R9  35.84,19.2 180 top
R10  15.16,24.21 180 top
R11  2.16,18.77 0 bottom
R12  0  [0402']  9.37,1.14 0 top
R13  0  [0402']  29.26,18.47 0 bottom
R14  0  [0402']  29.26,19.89 0 bottom
R15  17.17,5.49 0 bottom
R16  12.24,17.45 180 top
R17  18.03,11.63 0 top
R18  0  [0402']  15.67,22.53 180 top
R19  33  [0402']  12.19,15.93 180 top
R20  12.73,19.02 0 top
R21  7.8,12.01 180 top
R22  7.8,12.7 180 top
R23  7.29,13.34 180 top
R24  14.68,14.17 180 top
R26  20.88,5.41 0 bottom
S1  5.46,20.04 90 bottom
SKT1  18.92,15.18 0 bottom
TP1  0.99,10.77 0 top
TP2  29.39,1.14 0 top
TP3  27.38,1.14 0 top
U1  18.92,15.21 180 bottom
U3  6.32,22.48 270 top
U4  34.04,16.46 0 top
U5  20.9,21.89 180 top
U6  7.24,24.43 270 bottom
U7  11.56,23.85 180 top
U8  28.78,6.63 270 top
U9  11.56,9.96 90 top
U10  3.94,7.9 270 top
U11  9.78,18.9 90 top

### Tracks (layer width: path | path; a pad name or v marks a point on that pad's centre or on a via)
CAM_GPIO172  (via drill 0.25, 0.65 layers 1-2)
  Top 0.254: J1.40 15.42,3.82 v15.26,3.97 | v36.23,15.44 36.25,15.47 36.25,17.22 v36.02,17.45
  Route2 0.254: v15.26,3.97 16.14,3.1 23.06,3.1 23.39,3.43 31.11,3.43 31.19,3.51 31.19,12.29 31.17,12.32 35.15,12.32 35.53,12.7 35.53,14.63 36.23,15.32 v36.23,15.44
  Bottom 0.203: 31.93,18.29 31.94,18.28 J4.2 32.54,18.29
  Bottom 0.254: R13.1 30.03,18.28 J4.2 35.19,18.28 v36.02,17.45
CAM_GPIO173  (via drill 0.25)
  Top 0.203: J1.14 21.92,1.17 v21.95,1.14 | v27.71,18.01 27.15,17.45 v25.93,17.45
  Top 0.254: v28.78,21.69 28.78,19.08 v27.71,18.01
  Bottom 0.203: v21.95,1.14 23.04,2.24 23.04,7.91 26.14,11.01 26.14,17.25 v25.93,17.45
  Bottom 0.254: J4.3 28.72,17.03 27.74,18.01 v27.71,18.01 | v28.78,21.69 28.83,21.69 29.84,20.68 R14.1
CAM_GPIO178  (via drill 0.25)
  Top 0.254: v27.92,16.51 27.82,16.41 27.82,15.97 27.5,15.65 v25.55,15.65 | J1.19 20.42,7.19 21.82,8.59 v22.1,8.59
  Bottom 0.203: 31.8,15.67 31.91,15.78 32.36,15.78 | 30.56,15.78 32.36,15.78 | 32.36,15.78 J4.4
  Bottom 0.254: v25.55,15.65 25.76,15.65 25.76,11.17 24.39,9.8 22.27,9.8 22.1,9.64 v22.1,8.59 | 30.56,15.78 29.74,16.59 28.07,16.59 27.99,16.51 v27.92,16.51
CAM_PCLK  (via drill 0.25)
  Top 0.203: J1.39 | 8.51,8.32 9.66,7.16 11.25,7.16 11.29,7.2 | 11.61,15.72 R19.2
  Top 0.254: 8.51,8.32 8.51,10.44 | 8.51,10.44 9.5,11.43 9.5,13.61 11.61,15.72 | J1.39 15.42,7.36 15.29,7.49 v14.78,7.49 | v11.24,7.24 11.29,7.2 | 8.51,10.44 8.18,10.77 v8.18,10.92 | 0.99,11.67 v1.02,11.7 0.99,11.67 | 0.99,11.67 0.99,11.45 | 0.99,11.67 TP1.TP
  Bottom 0.254: v14.78,7.49 14.45,7.16 11.32,7.16 v11.24,7.24 | v8.18,10.92 8.18,11.13 6.42,12.88 2.2,12.88 v1.02,11.7
FRAME_VALID  (via drill 0.25)
  Top 0.203: J1.4 24.4,2.52
  Top 0.254: v24.64,4.22 24.42,4 J1.4 24.42,1.23 24.51,1.14 TP3.TP
  Bottom 0.203: 21.39,19.73 U1.28
  Bottom 0.254: U1.28 21.37,20.59 22.3,21.51 24.76,21.51 27.05,19.23 27.05,15.17 27.14,15.08 | 27.33,14.89 27.14,15.08 | 24.69,4.22 v24.64,4.22 27.33,6.91 27.33,14.89 | 27.33,14.89 27.14,15.08
GND  (via drill 0.25)
  Top 0.508: J5.4 5.44,15.69 | C21.2 6.18,24.51
  Bottom 0.254: 6.2,10.56 J6.3 | J6.4 5.57,11.81
  Bottom 0.305: J2.6 6.1,5.18 | 5.32,11.73 J6.4
  Bottom 0.508: 5.44,11.85 J6.4 | S1.1 4.51,18.14 | 4.51,21.94 S1.2
  other vias: 16.21,4.57 21.44,17.91 24.79,14.1 21.51,4.7 19.18,1.02 15.37,0.97 19.28,15.75 13.08,14.07 10.57,16.84 25.07,19.13 1.12,8.74
  pour Route15 (isolate 0.254): -0.38,26.64 -0.38,-0.53 38.23,-0.53 38.23,26.9 -0.38,26.9
  pour Bottom (isolate 0.254): -0.38,26.9 38.23,26.9 38.23,-0.53 -0.38,-0.53 -0.38,-0.28
  pour Top (isolate 0.254): -0.66,27.15 -0.66,-0.79 38.51,-0.79 38.51,27.15
I2C_SCL  (via drill 0.25)  (1 unrouted)
  Top 0.203: U11.3 10.88,19.1 v11.06,19.28 12.21,19.28 R20.1
  Top 0.254: 23.45,6.12 J1.7 23.42,7.13 24.59,8.29 24.59,10 22.5,12.09 21.57,12.09 20.55,13.12 20.55,16.51 20.12,16.94 17.65,16.94 | 17.65,16.94 13.38,16.94 v13.28,17.05 | 17.68,16.92 17.65,16.94
  Bottom 0.203: U1.15 14.44,16.95 | 14.44,16.95 14.53,16.86 | 14.44,16.95 14.25,16.95 | 14.25,16.95 14.09,16.95 | v11.06,19.28 13.39,16.95 14.25,16.95
  Bottom 0.254: 14.44,16.95 U1.15
I2C_SDA  (via drill 0.25)
  Top 0.203: J1.8 v23.42,1.16 | U11.2 11.51,18.7 12.55,17.65 12.55,17.51 R16.1
  Top 0.254: 15.62,17.65 v15.6,17.68 | 12.55,17.65 15.62,17.65 | 15.62,17.65 20.07,17.65 20.95,16.76 20.95,13.44 20.95,13.28 21.74,12.5 22.67,12.5 25.36,9.8 v26.24,9.8
  Bottom 0.254: v23.42,1.16 23.42,7.09 26.09,9.75 26.19,9.75 v26.24,9.8 | v15.6,17.68 14.44,17.68 U1.16
LINE_VALID  (via drill 0.25)
  Top 0.203: v26.15,8.49 26.12,8.52
  Top 0.254: J1.3 24.49,6.16 24.49,7.27 25.68,8.46 25.63,8.46 25.66,8.49 v26.15,8.49 | v29.29,2.21 29.29,1.24 TP2.TP
  Bottom 0.254: 26.54,19.13 26.45,19.21 | 26.45,19.21 24.56,21.11 22.47,21.11 22.07,20.71 U1.29 | U1.29 | 26.45,19.21 26.64,19.02 26.64,15 26.92,14.72 26.92,9.26 v26.15,8.49 26.15,8.32 25.02,7.19 25.02,5.56 23.98,4.52 23.98,3.4 25.17,2.21 v29.29,2.21
N$1  (via drill 0.25)  (1 unrouted)
  Top 0.203: 11.06,10.16 10.17,10.16 9.47,9.46 9.47,8.38 v9.4,8.31
  Bottom 0.254: J2.3 9.87,7.83 v9.4,8.31
N$2
  Bottom 0.203: 21.49,10.6 U1.45
  Bottom 0.254: 21.49,10.6 21.49,5.76 R26.1
N$3  (via drill 0.25)
  Top 0.203: v17.54,1.06 16.74,1.06 16.42,1.37 J1.36
  Bottom 0.203: 19.56,1.8 20.57,1.8 21.26,2.49 21.26,3.91 20.62,4.55 R26.2
  Bottom 0.254: 19.56,1.8 17.54,1.8 v17.54,1.06
N$4  (via drill 0.25)
  Top 0.254: v20.22,9.04 20.19,9.02 18.39,9.02 18.39,10.13 R3.1
  Bottom 0.203: U1.46 20.78,10.61
  Bottom 0.254: v20.22,9.04 20.68,9.5 U1.46
N$5
  Top 0.254: J1.35 16.41,6.11 16.41,6.95 15.71,7.65 15.71,8.53 16.56,9.38 16.56,9.96 16.87,10.26 R3.2
N$6
  Bottom 0.203: U1.47
  Bottom 0.254: U1.47 19.92,10.66 19.99,10.6 19.99,9.68 19.61,9.3 19.61,8.79 20.04,8.36 R4.1
N$7  (via drill 0.25)
  Top 0.254: J1.34 16.92,3.7 v16.81,3.81
  Bottom 0.203: 18.67,4.6 18.67,3.59 18.33,3.25 17.84,3.25 17.29,3.81 v16.81,3.81
  Bottom 0.254: v16.81,3.81 16.87,3.81 | R4.2 19.5,5.44 18.67,4.6
N$8  (via drill 0.25)
  Top 0.254: v19.05,9.63 19.05,10.34 18.44,10.95 R5.1
  Bottom 0.203: 19.22,10.66 U1.48
  Bottom 0.254: v19.05,9.63 19.22,9.8 19.22,10.66
N$9  (via drill 0.25)
  Top 0.203: v16.36,7.85 16.36,7.63 16.92,7.07 J1.33
  Top 0.254: 17.8,10.85 R5.2 16.49,10.95 16.23,10.68 15.95,10.41 v15.95,9.64
  Bottom 0.254: v15.95,9.64 16,9.59 16,8.22 v16.36,7.85
N$10
  Bottom 0.203: U1.1
  Bottom 0.254: R6.1 18.64,5.46 | R6.1 18.65,5.47 | U1.1 18.57,10 18.47,9.9 18.19,9.9 17.83,9.55 17.83,8.06 17.8,8.04 17.8,6.86 18.62,6.04 R6.1
N$11  (via drill 0.25)
  Top 0.254: J1.32 17.44,2.51 17.44,4.41 v17.78,4.75
  Bottom 0.254: R6.2 17.88,5.21 17.88,4.75 v17.78,4.75
N$12  (via drill 0.25)
  Top 0.254: v17.22,9.02 17.53,8.72 17.53,8.36 R7.1
  Bottom 0.203: 17.75,10.6 U1.2
  Bottom 0.254: U1.2 17.87,10.16 17.43,9.72 17.43,9.23 v17.22,9.02
N$13
  Top 0.203: U8.7 30.25,6.83 30.61,7.19 30.61,8.76 31.15,9.3 J3.3
N$14
  Top 0.254: J1.31 17.42,7.11 16.99,7.54 R7.2
N$15
  Top 0.254: U5.2 20.9,23.9 21.08,24.08 R1.2
N$16
  Top 0.254: R1.1 26.31,24.08 OSC1.3
N$17  (via drill 0.25)  (1 unrouted)
  Top 0.203: U9.7 10.59,9.76 v10.05,9.22
  Bottom 0.254: 11.07,5.2 J2.2 11,5.28 11,6.55 10.62,6.93 10.62,7.57 10.69,7.57 11.05,7.93 11.05,8.43 10.21,9.27 10.1,9.27 v10.05,9.22
N$18
  Top 0.203: U8.6 30.59,6.43 31.06,6.91 31.06,7.7 31.42,8.05 J3.2
N$19
  Top 0.152: U8.2 26.79,6.83 26.16,6.2 25.03,6.2 24.97,6.14
  Top 0.203: 24.97,6.14 J1.1
N$20
  Top 0.152: J1.2 26.14,2.49 26.64,3 26.64,6.05 27.03,6.43 U8.3
N$21
  Top 0.61: C22.2 U10.4
N$22
  Bottom 0.203: U1.3 17.17,10.38 16.61,9.82
  Bottom 0.254: 16.61,9.82 16.61,8.54 16.97,8.18 16.97,7.53 16.87,7.42 16.87,6.76 17.42,6.2 R15.1
N$23
  Top 0.61: U4.4 R9.2 34.99,20.08 34.78,20.28 R8.1
N$24  (via drill 0.25)
  Top 0.254: J1.30 17.92,3.67 v18.08,3.84
  Bottom 0.254: v18.08,3.84 17.83,3.84 16.91,4.76 R15.2
N$25
  Top 0.254: R2.1 19.93,20.58 U5.4
N$26  (via drill 0.25)
  Top 0.203: R2.2 18.66,18.73
  Top 0.254: 18.66,18.73 v17.86,18.73
  Bottom 0.254: U1.5 15.75,10.74 15.75,11.91 17.86,14.02 17.86,17.14 | v17.86,18.73 17.86,17.14 | 17.86,17.14
N$27
  Bottom 0.508: S1.3 6.36,22.19
  Bottom 0.61: 6.36,22.19 U6.3 | S1.4 S1.3
N$28  (via drill 0.25)
  Top 0.254: v11.58,23.6 11.58,25.12 U7.2
  Bottom 0.254: v11.58,23.6 11.46,23.47 9.74,23.47 9.5,23.72 8.99,23.72 8.75,23.47 U6.2
N$29  (via drill 0.25)
  Top 0.254: v10.26,21.36 10.61,21.71 U7.4
  Bottom 0.254: U1.17 14.4,18.39 13.33,18.39 10.36,21.36 v10.26,21.36
N$30
  Bottom 0.508: R11.1 3.01,19.67 1.28,21.4 LED1.A
N$31
  Top 0.203: J1.44 14.37,2.54
  Top 0.254: R12.2 11.45,1.14 11.73,0.86 14.05,0.86 14.43,1.24 14.42,1.25 J1.44
N$32
  Bottom 0.203: U1.27
  Bottom 0.254: R13.2 28.43,18.47 24.97,21.92 22.12,21.92 20.68,20.47 U1.27
N$33
  Bottom 0.254: R14.2 27.58,19.89 25.14,22.33 21.95,22.33 19.99,20.36 19.99,19.73 U1.26
N$34  (via drill 0.25)
  Top 0.61: D1.A v9.23,3.04 v9.22,3.05
  Bottom 0.203: J2.1 12.37,3.86 10.29,3.86 9.47,3.05 v9.22,3.05
N$35
  Top 0.203: 12.03,9.78 U9.2 13.45,9.76 13.63,9.93 14.12,10.42
  Top 0.254: J1.15 21.42,7.01 23.37,8.96 23.37,9.5 | 23.37,8.96 23.37,9.5 | 23.37,9.5 22,10.87 20.99,10.87 18.91,12.95 15.8,12.95 14.12,11.28 14.12,10.42
N$36  (via drill 0.25)
  Top 0.203: J1.16 21.42,3.68 22.25,3.68 v22.45,3.89 | 20.66,10.62 20.58,10.7 18.74,12.55 17.19,12.55 | v13.51,10.67 13.39,10.67 12.87,10.16 U9.3
  Top 0.254: v22.72,9.17 21.42,10.46 20.82,10.46 | 20.82,10.46 20.82,10.47 | 20.82,10.46 20.58,10.7 | 17.19,12.55 16.02,12.55 14.53,11.05 14.53,10.01 v13.87,9.35
  Bottom 0.203: v22.45,3.89 22.68,4.11 22.68,8.8 22.72,8.84 v22.72,9.17 | v13.87,9.35 13.51,9.7 v13.51,10.67
N$37  (via drill 0.25)
  Top 0.203: J5.2 6.81,18.23 v7.23,18.65 | 7.72,17.54 v7.72,17.47 7.72,17.78 8.64,18.7 U11.7
  Bottom 0.203: v7.23,18.65 7.72,18.16 v7.72,17.47
N$38
  Top 0.203: J5.3 6.99,16.98 7.14,17.12 7.14,17.73 8.51,19.1 U11.6
N$39
  Bottom 0.406: J6.2 J6.1 | D2.A 7.3,8.06
  Bottom 0.61: 7.3,8.06 J6.1
N$40  (via drill 0.25)
  Top 0.254: v13.28,7.75 13.44,7.9 14.22,7.9 15.34,9.02 15.34,10.54 16.43,11.63 R17.1 17.72,11.63
  Bottom 0.254: v13.28,7.75 13.28,8.47 12.14,9.61 12.14,11.2 12.5,11.56 13,11.56 13.19,11.36 U1.7
N$41  (1 unrouted)
  Top 0.254: 18.33,11.59 R17.2 | R17.2 18.36,11.63 | 20.56,9.57 20.56,9.56 18.49,11.63 R17.2 | J1.29 17.93,6.1 17.93,8.49 18.01,8.56 19.74,8.56 19.86,8.43 20.47,8.43 20.83,8.79 20.83,8.99 20.85,9.02 20.83,9.04 20.83,9.29 20.47,9.65 20.46,9.65
N$42  (via drill 0.25)
  Top 0.254: R21.1 8.61,12.01 v8.84,12.24
  Bottom 0.254: v8.84,12.24 14.24,12.24 U1.8
N$43  (via drill 0.25)
  Top 0.203: J1.26 18.92,3.89 v19.25,4.22
  Top 0.254: v11.68,6.53 11.57,6.41 9.8,6.41 7.54,8.67 R21.2
  Bottom 0.203: v19.25,4.22 19.17,4.14 | 15.98,3.77 15.98,3.79
  Bottom 0.254: 19.17,4.14 19.17,3.52 18.52,2.87 16.88,2.87 15.98,3.77 | 15.98,3.79 13.13,6.63 11.79,6.63 v11.68,6.53
N$44  (via drill 0.25)
  Top 0.254: R22.1 8.31,12.7 v8.69,13.08
  Bottom 0.203: 14.39,12.8 U1.9
  Bottom 0.254: v8.69,13.08 8.69,13 13.07,13 13.3,12.76 U1.9
N$45  (via drill 0.65 layers 1-2)
  Top 0.254: J1.25 18.92,7.65 v18.9,7.67 | v7.96,7.11 7.09,7.98 7.09,12.32 7.47,12.7 R22.2
  Route2 0.254: v7.96,7.11 7.98,7.14 7.98,6.07 8.49,5.56 11.07,5.56 11.08,5.56 11.58,5.56 12.36,6.35 17.58,6.35 v18.9,7.67
N$46  (via drill 0.25)
  Top 0.254: v7.68,14.1 7.54,13.97 R23.1
  Bottom 0.254: v7.68,14.1 8.09,13.7 10.91,13.7 11.43,14.22 11.96,14.22 12.72,13.46 U1.10
N$47  (via drill 0.25)
  Top 0.203: v20.09,3.78 19.85,3.55 19.67,3.55 19.42,3.3 J1.24
  Top 0.254: R23.2 6.6,12.9 6.6,2.57 v7.06,2.11
  Bottom 0.254: v20.09,3.78 20.01,3.78 18.69,2.47 16.66,2.47 14.5,4.62 13.11,4.62 12.95,4.47 12.95,3.9 11.16,2.11 v7.06,2.11
N$48  (via drill 0.25)
  Top 0.254: R24.1 15.53,14.17 v15.67,14.03
  Bottom 0.254: v15.67,14.03 15.54,14.16 U1.11
N$49  (via drill 0.25)
  Top 0.254: v12.75,10.95 12.75,11.02 14.43,12.7 R24.2 | J1.23 19.42,6.94 20.51,8.03 20.64,8.03 21.26,8.65 21.26,9.44 | 20.67,10.04 21.26,9.44 | 21.26,9.44 18.56,12.14 16.25,12.14 14.93,10.82 14.93,9.55 v13.89,8.51
  Bottom 0.254: v12.75,10.95 12.75,10.74 12.9,10.59 12.9,9.45 13.67,8.69 13.72,8.69 v13.89,8.51
N$52  (via drill 0.25)
  Top 0.254: R18.1 18.03,22.53 v17.96,22.45
  Bottom 0.254: v17.96,22.45 18.57,21.84 U1.24
P1P8V  (via drill 0.25)  (2 unrouted)
  Top 0.152: U8.1 v26.12,7.23 v26.11,7.24
  Top 0.203: C41.1 U9.5 | U11.5 C43.1 v9.32,20.93 | C36.1 29.06,6.03 U8.5 | 14.98,22.42 R18.2 | v13.66,19.79 13.64,19.76 C8.1 12.98,19.74 R20.2 | U11.1 10.24,18.31 10.97,18.31 v11.25,18.03 11.4,18.03 R16.2 | 9.32,23.05 9.25,23.13 | C41.1 11.1,12.02 11.68,12.6 v11.68,13.61 | U9.1 12.36,9.36 12.57,9.14 12.57,8.36 v12.55,8.33
  Top 0.254: C36.1 29.06,4.98 v28.4,4.32 | 14.98,22.42 C7.1 v14.98,20.8 v14.99,20.8 | v23.24,22.99 23.26,22.96 C15.1 22.42,21.16 U5.5 | C35.1 15.55,14.86 v15.57,14.84 | C34.1 v15.6,16.23 | C31.2 12.51,21.1 12.51,22.45 | 12.51,22.45 U7.5 | R18.2 | R18.2 12.58,22.53 12.51,22.45 | R10.2 14.31,23.3 R18.2 | v9.25,23.11 9.19,23.16 C1.1 | 19.01,24.6 18.64,24.97 C19.1 | 19.01,24.6 19.03,24.58 v19.03,23.67 | C6.1 19.1,24.69 19.01,24.6 | C20.1 13.75,19.65 13.64,19.76
  Top 0.305: v13.89,3.82 13.92,3.82 J1.46 | C41.1
  Top 0.61: C21.1 7.42,24.54 U3.5 9.25,23.13 v9.25,23.11
  Bottom 0.203: v13.66,19.79 14.37,19.08 U1.18
  Bottom 0.254: U1.18 | U1.14 14.47,16.21 15.58,16.21 v15.6,16.23 | 15.54,14.87 v15.57,14.84 14.86,14.84 14.86,14.85 14.44,14.85 U1.12 | v14.99,20.8 15.07,20.72 U1.19
  pour Route2 (isolate 0.254): 7.24,23.93 7.24,22.33 8.59,22.33 8.59,17.48 11.3,17.48 11.3,7.09 10.08,7.09 10.08,3.4 14.76,3.4 14.76,4.9 23.34,4.9 23.34,3.8 30.78,3.71 30.78,6.05 26.54,6.05 26.54,10.11 16.15,10.11 16.15,19.51 24.05,19.51 24.05,23.93
P2P8V  (via drill 0.25)
  Top 0.203: v18.49,14.78 18.49,15.14 C14.1
  Top 0.254: C9.1 v22.4,17.02 | C10.1 23.09,16.13 v22.44,16.13 | C11.1 23.09,15.21 v22.45,15.21 | C12.1 23.06,14.38 v22.43,14.38 | C13.1 23.11,13.36 v22.43,13.36
  Top 0.61: 33.09,19.04 C26.2 | R8.2 | R8.2 33.11,21.03 33.11,22.39 33.1,22.4 v32.71,22.4 | U4.5 33.09,19.04 | 33.09,19.04 C26.2 | C26.2 R8.2 | R8.2
  Bottom 0.254: v22.43,13.36 22.43,13.28 22.95,12.76 U1.40 | v22.43,14.38 22.64,14.16 U1.38 | v22.45,15.21 22.8,14.86 U1.37 | v22.44,16.13 22.64,15.93 22.64,15.92 23,15.56 U1.36 | v22.4,17.02 23.37,17.02 U1.34 | v18.49,14.78 18.49,13.8 16.47,11.78 U1.4 | C2.1 28.07,13.13 28.08,13.14 v27.94,13.28 | 30.48,14.63 v30.5,14.63 29.83,13.95 C3.1 29.85,12.22 | C4.1 v31.27,13.28 | C5.1 31.82,22.4 v32.71,22.4 | C17.1 32.44,24.05 v32.46,24.03 | C18.1 31.29,25.3 v32.44,25.3
  pour Route2 (isolate 0.254): 28.83,26.64 34.87,26.64 34.87,12.73 30.81,12.73 30.81,6.35 26.85,6.35 26.85,10.41 16.48,10.41 16.48,19.2 19.05,19.2 19.05,11.25 27.64,11.25 27.64,7.57 29.64,7.57 29.64,12.78 21.95,12.78 21.95,17.83 28.83,17.83
P3P3V  (via drill 0.25)  (2 unrouted)
  Top 0.203: 11.11,8.68 U9.8 | C37.1 29.08,7.23 U8.8 | v7.42,16.52 7.68,16.52 8.79,17.63 C44.1
  Top 0.254: 9.33,17.64 U11.8 | C37.1 29.08,9.15 v28.73,9.42 | OSC1.1 27.94,22.08 v27.94,21.21 27.89,21.26 C16.1
  Top 0.305: v10.44,8.18 10.64,8.18 C42.1 11.11,8.68 | C44.1 9.33,17.64
  Top 0.508: J5.1 7.6,19.48 | 7.6,19.48 v7.62,19.46 | 7.6,19.48 7.62,19.5 C27.2 7.62,21.63 U3.4
  Top 0.61: OSC1.1 OSC1.4 | U10.5 C24.2 5.24,13.37 v5.51,13.64
  Bottom 0.305: C30.2 | 6.2,25.55 U6.4
  Bottom 0.508: 6.2,25.55 4.98,25.55 v4.9,25.48
  Bottom 0.61: v4.9,25.48 4.85,25.53 C30.2
  pour Route2 (isolate 0.254): -0.15,26.64 28.52,26.64 28.52,18.19 21.64,18.19 21.64,12.45 29.34,12.45 29.34,7.87 27.94,7.87 27.94,11.56 19.35,11.56 19.35,19.18 24.36,19.18 24.36,24.23 6.86,24.23 6.86,22.02 8.28,22.02 8.28,17.17 11,17.17 11,7.47 10.06,7.47 10.06,11.4 7.75,11.4 7.75,12.62 4.52,12.62 4.52,21.64 -0.15,21.64
P5V  (via drill 0.25)
  Top 0.254: D1.C 9.77,5.54
  Top 0.305: v12.14,1.57 12.92,2.36 J1.50 J1.48
  Top 0.61: C25.2 U4.1 | C25.2 34.47,13.72 35,14.25 34.99,14.26 U4.3 | C25.2 33.08,11.61 v32.38,10.92 | v2.59,11.02 C23.2 2.64,10.27 2.64,8.92 U10.1 | U10.3 1.31,6.95 v1.14,7.11 | D1.C 8.81,5.54 8.76,5.59 8.76,6.5 v8.79,6.53
  Bottom 0.508: 1.4,18.68 R11.2 | 1.31,17.72 v1.29,17.7 | C38.+ 1.31,16.29
  Bottom 0.61: R11.2 1.31,17.72 1.31,16.29 | 8.17,10.03 D2.C 8.17,10.03 | 8.17,10.03 v9.22,10.03
  pour Route2: 35.18,26.64 35.18,12.37 31.11,12.37 31.11,3.4 23.04,3.36 23.04,4.6 15.06,4.6 15.06,3.1 9.75,3.1 9.75,11.1 7.44,11.1 7.44,12.29 4.22,12.29 4.22,21.31 -0.15,21.31 -0.15,-0.23 38.05,-0.23 38.05,26.64
PIXCLK  (via drill 0.25)  (1 unrouted)
  Top 0.254: R19.1 v12.78,14.94
  Bottom 0.254: v12.78,14.94 12.78,15.21 13.13,15.56 U1.13
SLA_RESET_BAR  (via drill 0.25)
  Top 0.254: U7.1 12.54,25.17 15.44,25.17 16.01,24.6 R10.1 16.89,24.21 v17.4,23.7 | 18.05,13.45 17.93,13.45 | 17.93,13.45 16.59,13.45 v16.41,13.64 | v16.28,18.39 17.25,19.35 v17.25,20.83 | 17.93,13.45 19.01,13.45 21.18,11.28 22.16,11.28 23.77,9.67 23.77,8.74 22.26,7.22 22.21,7.22 21.92,6.94 J1.13
  Bottom 0.254: v16.28,18.39 16.41,18.26 v16.41,13.64 | v17.25,20.83 17.25,23.55 v17.4,23.7
STANDBY  (via drill 0.25)
  Top 0.254: 22.9,6.12 J1.9 22.92,7.2 24.15,8.43 24.15,8.54 24.18,8.57 24.18,9.84 22.33,11.69 21.4,11.69 18.99,14.1 18.41,14.1 | 18.44,14.07 18.41,14.1 | 18.41,14.1 18.21,14.3 v17.04,14.3
  Bottom 0.254: U1.22 17.04,19.58 v17.04,14.3